# Altium schematic sheet 1_V4.schdoc
size 713 x 330 mm; Name: A_A3; Symbol: A_A3; Device: A_A3; @Project Name: samrtclick; REV: 1; Date: 2023-02-28; Sheet: 1/1; Draw By: kano; Company: Your Company; Convert to PCB: yes; Add into BOM: yes; @Update Date: 2023-05-06; @Page No: 1; @Page Count: 1; @Schematic Name: V4; @Page Name: V4
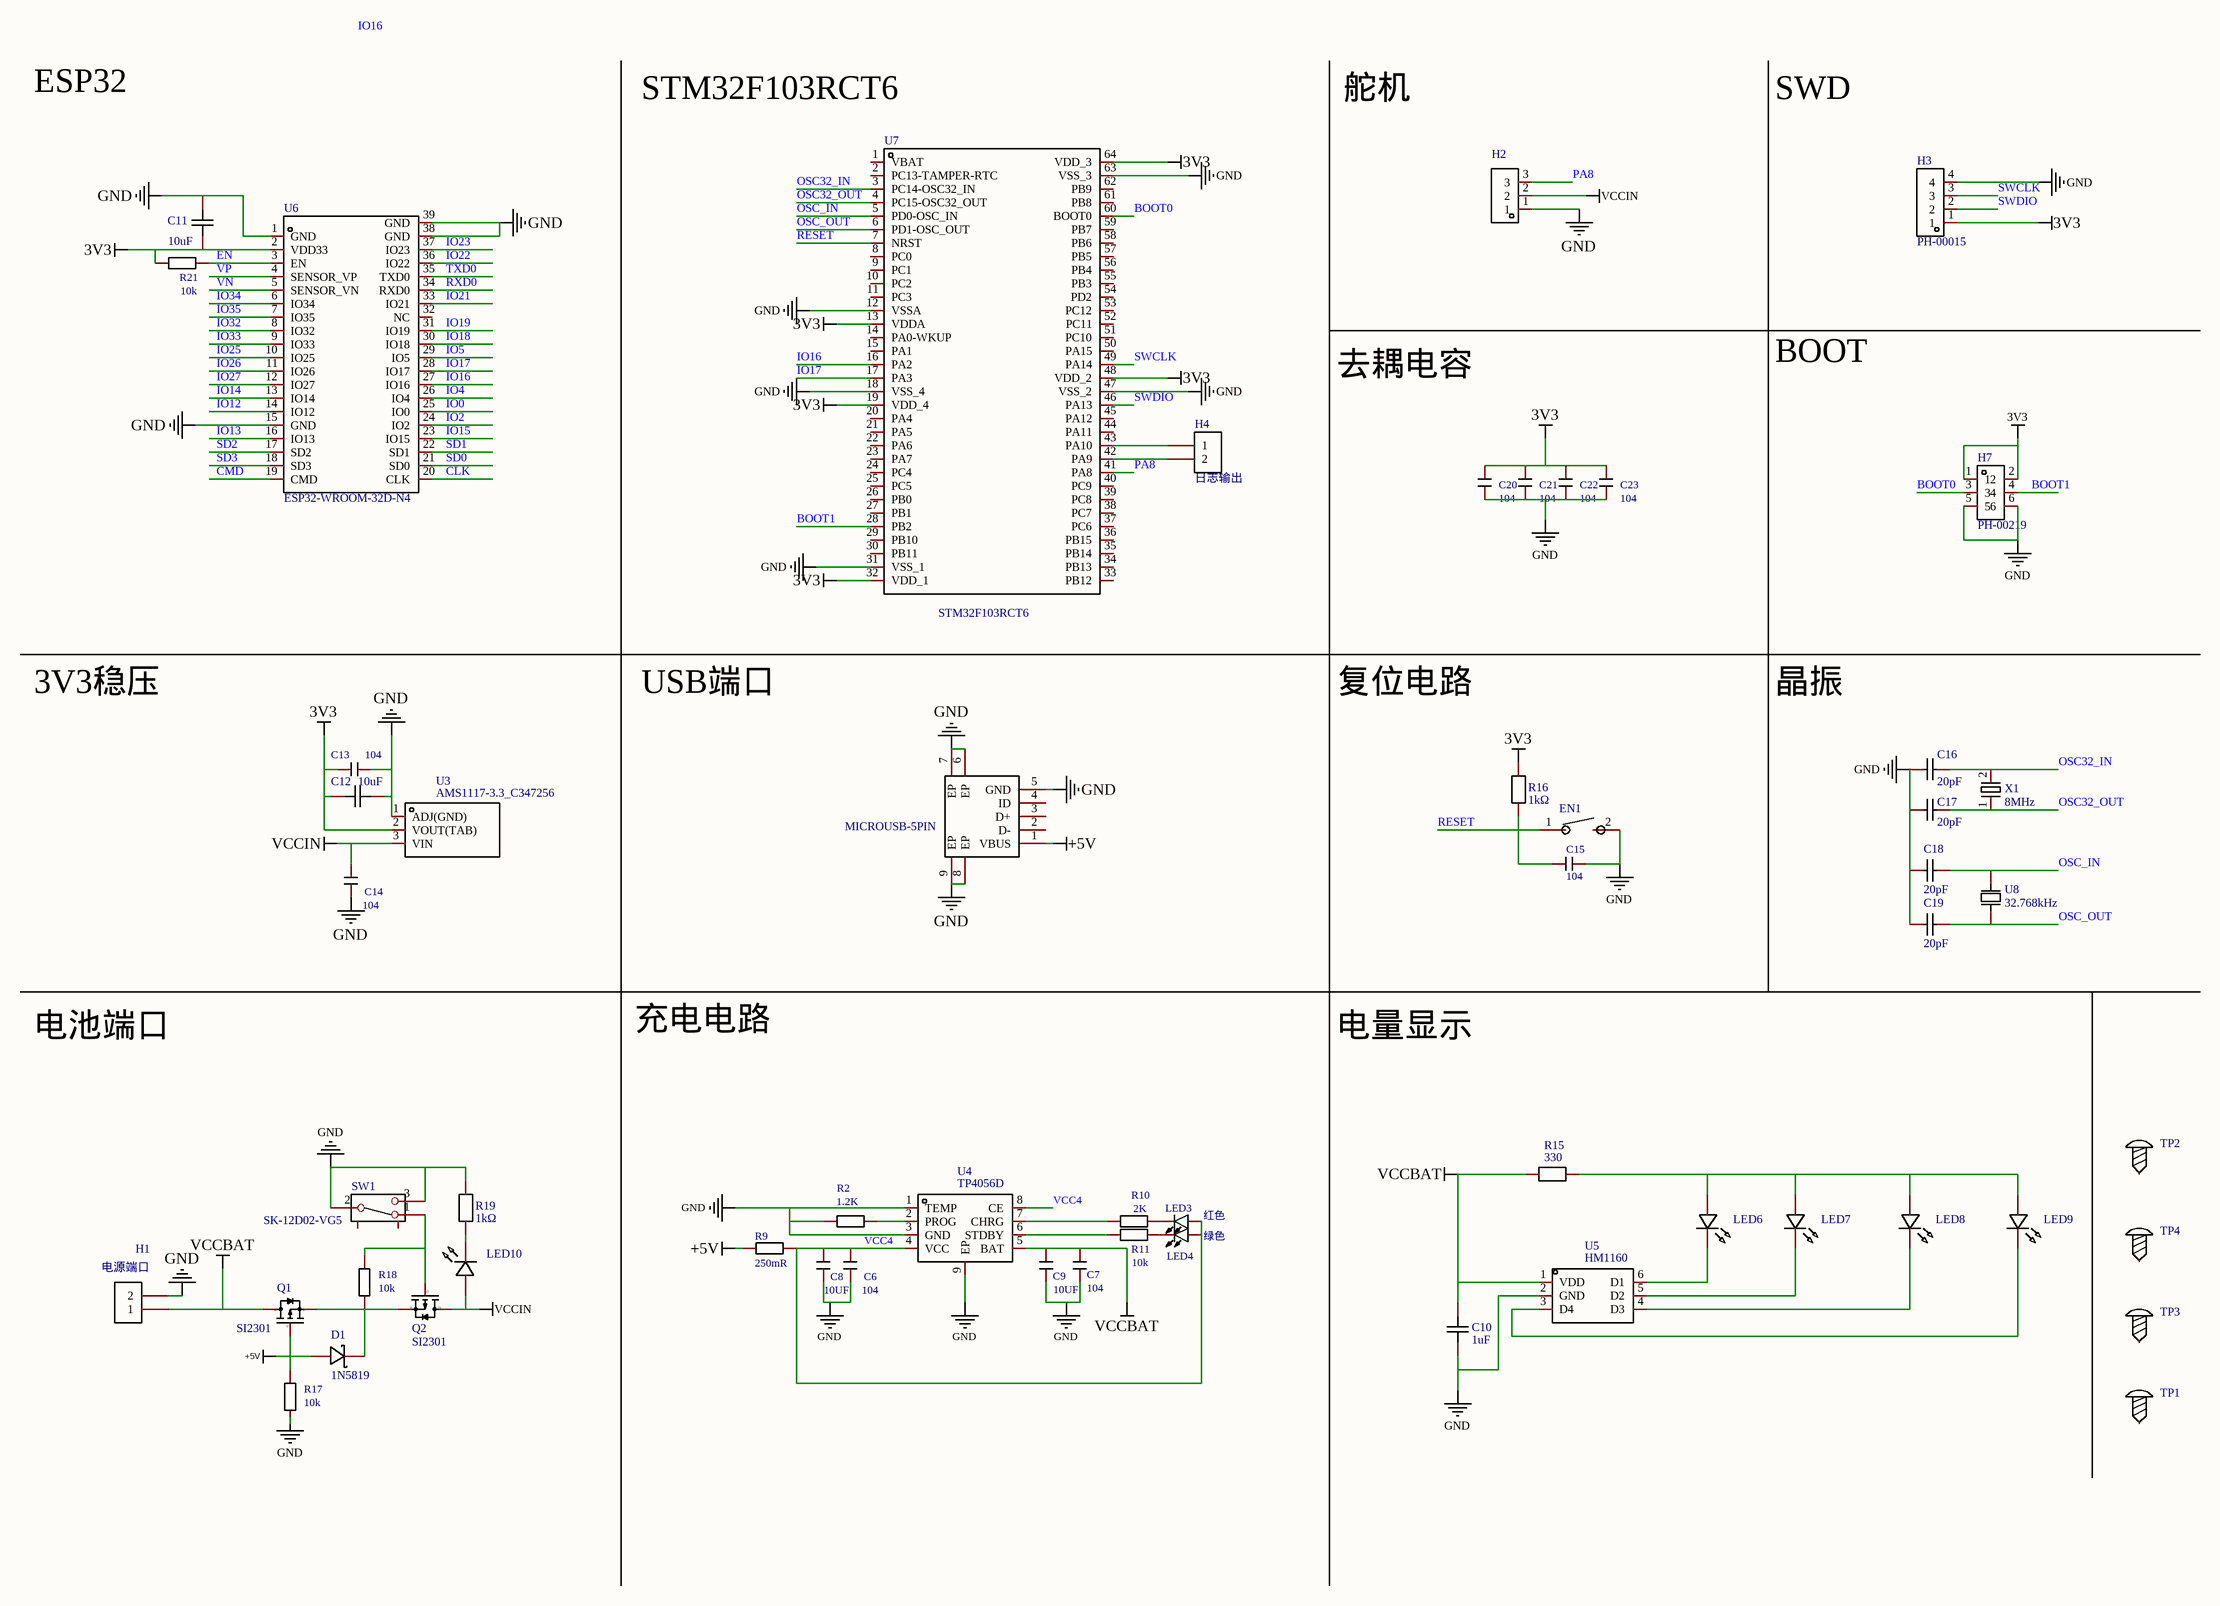
[diagram p0: 1_V4.schdoc]

## Parts
C6  104  [C0603]
C7  104  [C0603]
C8  10UF  [C0805]
C9  10UF  [C0805]
C10  1uF  [C0805]
C11  10uF  [C0603]
C12  10uF  [C0805]
C13  104  [C0603]
C14  104  [C0603]
C15  104  [C0603]
C16  20pF  [C0603]
C17  20pF  [C0603]
C18  20pF  [C0603]
C19  20pF  [C0603]
C20  104  [C0603]
C21  104  [C0603]
C22  104  [C0603]
C23  104  [C0603]
D1  1N5819  [SMA_L4.4-W2.6-LS5.0-RD]
EN1  TSA343G00-250J2  [SW-SMD_L4.0-W2.9-LS5.0]  (value not drawn)
H1  电源端口  [HDR-TH_2P-P2.54-V-M-1]
H2  Z-211-0311-0021-001  [HDR-TH_3P-P2.54-V-M-1]  (value not drawn)
H3  PH-00015  [HDR-TH_4P-P2.54-V-M]
H4  日志输出  [HDR-TH_2P-P2.54-V-M-1]
H7  PH-00219  [HDR-TH_6P-P2.54-V-M-R2-C3-S2.54]
LED3  红色  [L0603-RD]
LED4  绿色  [L0603-RD]
LED6  LED-0603_R  [LED0603_RED]  (value not drawn)
LED7  LED-0603_R  [LED0603_RED]  (value not drawn)
LED8  LED-0603_R  [LED0603_RED]  (value not drawn)
LED9  LED-0603_R  [LED0603_RED]  (value not drawn)
LED10  LED-0603_R  [LED0603_RED]  (value not drawn)
NO1  MICROUSB-5PIN  [USB-SMD_5P_MICROUSB-5PIN]
Q1  SI2301  [SOT-23-3_L2.9-W1.3-P1.90-LS2.4-BR]
Q2  SI2301  [SOT-23-3_L2.9-W1.3-P1.90-LS2.4-BR]
R2  1.2K  [R0603]
R9  250mR  [R1206_1]
R10  2K  [R0603]
R11  10k  [R0603]
R15  330  [R0603]
R16  1kΩ  [R0603]
R17  10k  [R0603]
R18  10k  [R0603]
R19  1kΩ  [R0603]
R21  10k  [R0603]
SW1  SK-12D02-VG5  [SW-TH_SK-12D02-VG5]
TP1  M2螺丝  [M2螺丝]  (value not drawn)
TP2  M2螺丝  [M2螺丝]  (value not drawn)
TP3  M2螺丝  [M2螺丝]  (value not drawn)
TP4  M2螺丝  [M2螺丝]  (value not drawn)
U3  AMS1117-3.3_C347256  [SOT-223-4_L6.5-W3.5-P2.30-LS7.0-BR]
U4  TP4056D  [ESOP-8_L4.9-W3.9-P1.27-LS6.0-TL-EP]
U5  HM1160  [SOT23-6]
U6  ESP32-WROOM-32D-N4  [WIFIM-SMD_39P-L25.5-W18.0-P1.27-BL]
U7  STM32F103RCT6  [LQFP-64_L10.0-W10.0-P0.50-LS12.0-BL]
U8  32.768kHz  [CRYSTAL-SMD_L3.2-W1.5-3]
X1  8MHz  [HC-49S_L11.0-W4.7-P4.88]

## Nets
3V3: C11.1 C12.1 C13.2 C20.1 C21.1 C22.1 C23.1 H3.1 H7.1 H7.2 R16.1 R21.1 U3.2(VOUT(TAB)) U6.2(VDD33) U7.13(VDDA) U7.19(VDD_4) U7.32(VDD_1) U7.48(VDD_2) U7.64(VDD_3)
+5V: D1.2(A) NO1.1(VBUS) Q1.1(G) R9.1 R17.2
GND: C6.1 C7.1 C8.1 C9.1 C10.1 C11.2 C12.2 C13.1 C14.1 C15.1 C16.2 C17.2 C18.2 C19.2 C20.2 C21.2 C22.2 C23.2 EN1.2 H1.2 H2.1 H3.4 H7.5 H7.6 NO1.5(GND) NO1.6(EP) NO1.7(EP) NO1.8(EP) NO1.9(EP) R2.1 R17.1 R19.1 SW1.2 SW1.3 U3.1(ADJ(GND)) U4.1(TEMP) U4.3(GND) U4.9(EP) U5.2(GND) U6.1(GND) U6.15(GND) U6.38(GND) U6.39(GND) U7.12(VSSA) U7.18(VSS_4) U7.31(VSS_1) U7.47(VSS_2) U7.63(VSS_3)
VCCBAT: C7.2 C9.2 C10.2 H1.1 Q1.3(D) R15.1 U4.5(BAT) U5.1(VDD)
VCCIN: C14.2 H2.2 LED10.1 Q2.3(D) U3.3(VIN)
BOOT0: H7.3 U7.60(BOOT0)
BOOT1: H7.4 U7.28(PB2)
CLK: U6.20(CLK)
CMD: U6.19(CMD)
EN: R21.2 U6.3(EN)
IO0: U6.25(IO0)
IO2: U6.24(IO2)
IO4: U6.26(IO4)
IO5: U6.29(IO5)
IO12: U6.14(IO12)
IO13: U6.16(IO13)
IO14: U6.13(IO14)
IO15: U6.23(IO15)
IO16: U6.27(IO16) U7.16(PA2)
IO17: U6.28(IO17) U7.17(PA3)
IO18: U6.30(IO18)
IO19: U6.31(IO19)
IO21: U6.33(IO21)
IO22: U6.36(IO22)
IO23: U6.37(IO23)
IO25: U6.10(IO25)
IO26: U6.11(IO26)
IO27: U6.12(IO27)
IO32: U6.8(IO32)
IO33: U6.9(IO33)
IO34: U6.6(IO34)
IO35: U6.7(IO35)
OSC32_IN: C16.1 U7.3(PC14-OSC32_IN) X1.2(GND)
OSC32_OUT: C17.1 U7.4(PC15-OSC32_OUT) X1.1
OSC_IN: C18.1 U7.5(PD0-OSC_IN) U8.2(OSC2)
OSC_OUT: C19.1 U7.6(PD1-OSC_OUT) U8.1(OSC1)
PA8: H2.3 U7.41(PA8)
RESET: C15.2 EN1.1 R16.2 U7.7(NRST)
RXD0: U6.34(RXD0)
SD0: U6.21(SD0)
SD1: U6.22(SD1)
SD2: U6.17(SD2)
SD3: U6.18(SD3)
SWCLK: H3.3 U7.49(PA14)
SWDIO: H3.2 U7.46(PA13)
TXD0: U6.35(TXD0)
VCC4: C6.2 C8.2 LED3.1(A) LED4.1(A) R9.2 U4.4(VCC) U4.8(CE)
VN: U6.5(SENSOR_VN)
VP: U6.4(SENSOR_VP)
NetD1_1: D1.1(C) Q1.2(S) Q2.2(S) R18.1
NetH4_1: H4.1 U7.43(PA10)
NetH4_2: H4.2 U7.42(PA9)
NetLED3_2: LED3.2(K) R10.2
NetLED4_2: LED4.2(K) R11.2
NetLED6_1: LED6.1 LED7.1 LED8.1 LED9.1 R15.2
NetLED6_2: LED6.2 U5.6(D1)
NetLED7_2: LED7.2 U5.5(D2)
NetLED8_2: LED8.2 U5.4(D3)
NetLED9_2: LED9.2 U5.3(D4)
NetLED10_2: LED10.2 R19.2
NetQ2_1: Q2.1(G) R18.2 SW1.1
NetR2_2: R2.2 U4.2(PROG)
NetR10_1: R10.1 U4.7(CHRG)
NetR11_1: R11.1 U4.6(STDBY)

Not connected (* = marked no-connect by the designer): NO1 2(D-) 3(D+) 4(ID); SW1 4 5; TP1 1; TP2 1; TP3 1; TP4 1; U6 32(NC); U7 1(VBAT) 2(PC13-TAMPER-RTC) 8(PC0) 9(PC1) 10(PC2) 11(PC3) 14(PA0-WKUP) 15(PA1) 20(PA4) 21(PA5) 22(PA6) 23(PA7) 24(PC4) 25(PC5) 26(PB0) 27(PB1) 29(PB10) 30(PB11) 33(PB12) 34(PB13) 35(PB14) 36(PB15) 37(PC6) 38(PC7) 39(PC8) 40(PC9) 44(PA11) 45(PA12) 50(PA15) 51(PC10) 52(PC11) 53(PC12) 54(PD2) 55(PB3) 56(PB4) 57(PB5) 58(PB6) 59(PB7) 61(PB8) 62(PB9)

## Notes on the sheet
- ESP32
- STM32F103RCT6
- 舵机
- SWD
- BOOT
- 去耦电容
- 3V3稳压
- USB端口
- 复位电路
- 晶振
- 电池端口
- 充电电路
- 电量显示
- Labels drawn without touching a wire or pin: IO16
- 2023-05-06
- 1
- V4
- 2
- 3
- 4
- 5
- 6
- 7
- 8
- A
- B
- C
- D
- E
- TITLE:
- REV:
- Date:
- Company:
- Drawn By:
- Sheet:

## Library data of the parts
C6 C7 C13-C15 C20-C23 = 104: 3DModel: C0603_L1.6-W0.8-H0.8; BOM名称: 无极性贴片电容; 版权归属: 源创客; Add into BOM: yes; Name: 104; Symbol: 104; Device: 104; link: https://item.szlcsc.com/362304.html; 学习资源: www.ooocke.com; Convert to PCB: yes; Origin Footprint: C0603
C8 C9 = 10UF: 3DModel: C0805_L2.0-W1.3-H1.3; BOM名称: 无极性贴片电容; 版权归属: 源创客; Add into BOM: yes; Name: 10UF; Symbol: 10UF; Device: 10UF; link: https://item.szlcsc.com/373011.html; 学习资源: www.ooocke.com; Convert to PCB: yes; Origin Footprint: C0805
C10 = 1uF: 3DModel: C0805_L2.0-W1.3-H1.3; Add into BOM: yes; Name: 1uF; Symbol: 1uF; Device: 1uF; link: https://item.szlcsc.com/373011.html; Convert to PCB: yes; Origin Footprint: C0805
C11 = 10uF: 3DModel: C0603_L1.6-W0.8-H0.8; Add into BOM: yes; Name: 10uF; Symbol: 10uF; Device: 10uF; link: https://item.szlcsc.com/362304.html; Convert to PCB: yes; Origin Footprint: C0603
C12 = 10uF: 3DModel: C0805_L2.0-W1.3-H1.3; Add into BOM: yes; Name: 10uF; Symbol: 10uF; Device: 10uF; link: https://item.szlcsc.com/373011.html; Convert to PCB: yes; Origin Footprint: C0805
C16-C19 = CL10C200JB8NNNC: 温度系数:C0G;容值:20pF;精度:±5%;额定电压:50V;; Manufacturer: SAMSUNG(三星); Add into BOM: yes; Temperature Coefficient: C0G; Tolerance: ±5%; Voltage Rated: 50V; Name: 20pF; Symbol: CL10C200JB8NNNC; Device: CL10C200JB8NNNC; LCSC Part Name: 20pF ±5% 50V; Supplier Part: C1648; Manufacturer Part: CL10C200JB8NNNC; Supplier Footprint: 0603; JLCPCB Part Class: Basic Part; Datasheet: https://atta.szlcsc.com/upload/public/pdf/source/20160103/1457707686863.pdf; Supplier: LCSC; Convert to PCB: yes; Value: 20pF
D1 = 1N5819_C437199: 直流反向耐压(Vr):40V;平均整流电流(Io):1A;正向压降(Vf):500mV@1A;; Manufacturer: KEXIN(科信); Add into BOM: yes; Reverse Voltage (Vr): 40V; Average Rectified Current (Io): 1A; Name: 1N5819; Symbol: 1N5819_C437199; Device: 1N5819_C437199; LCSC Part Name: 40V 1A 500mV@1A; Supplier Part: C437199; Manufacturer Part: 1N5819; Supplier Footprint: SMA; JLCPCB Part Class: Extended Part; Datasheet: https://atta.szlcsc.com/upload/public/pdf/source/20191012/C437199_83583E622A6684E767605E43C169C596.pdf; Supplier: LCSC; Convert to PCB: yes; Forward Voltage (Vf@If): 500mV@1A
EN1 = TSA343G00-250J2: 触点电流:50mA;额定电压(DC):12V;绝缘电阻:100MΩ;电路结构:单刀单掷;安装方式:立贴;按钮形状:圆形按钮;按钮/盖帽颜色:黑色;带灯:无;作用力:250gf@±50gf;机械寿命:50000;工作温度:-25℃~+70℃;引脚样式:SMD接片;开关长度:3.95mm;开关宽度:2.9mm;开关高度:2mm;带支架:否;; Manufacturer: BRIGHT(博瑞泰); Add into BOM: yes; Contact Current: 50mA; Voltage Rating (DC): 12V; Insulation Resistance: 100MΩ; Circuit: 单刀单掷; Actuator Style: 圆形按钮; Actuator/Cap Color: 黑色; With Lamp: 无; Mechanical Life: 50000; Pin Style: SMD接片; Switch Length: 3.95mm; Switch Width: 2.9mm; Switch Height: 2mm; Strike Gundam: 否; Actuator Orientation: 顶部触动; 3DModel: SW-SMD_L4.0-W2.9-H2-P4.15-EH; Paste Type: expand; Origin Footprint: SW-SMD_L4.0-W2.9-P4.15-EH; Name: TSA343G00-250J2; Symbol: TSA343G00-250J2; Device: TSA343G00-250J2; LCSC Part Name: 3*4 两脚小龟不带柱  250gf; Supplier Part: C354946; Manufacturer Part: TSA343G00-250J2; Supplier Footprint: SMD; JLCPCB Part Class: Extended Part; Datasheet: https://atta.szlcsc.com/upload/public/pdf/source/20190426/C354946_6B70DFBDFA823D17B8EB46FB9599F693.pdf; Supplier: LCSC; Convert to PCB: yes; Mounting Style: 立贴; Operating Force: 250gf@±50gf; Operating Temperature: -25℃~+70℃; Illumination Color: -; link: https://item.szlcsc.com/457634.html; Assembly Type: smtWeld
H1 H4 = 电源端口: Manufacturer: TE Connectivity(美国泰科); Manufacturer Part: 3-644456-2; 3DModel: HDR-M-2.54_1x2; Add into BOM: yes; Symbol: 电源端口; Device: 电源端口; link: https://item.szlcsc.com/366904.html; Supplier: LCSC; Supplier Part: C90288; JLCPCB Part Class: Extended Part; Convert to PCB: yes; Origin Footprint: HDR-TH_2P-P2.54-V-M-1
  H1: Name: 电源端口
  H4: Name: 日志输出
H2 = Z-211-0311-0021-001: Manufacturer: Nextron(正凌); 3DModel: HDR-M-2.54_1x3; Add into BOM: yes; Name: Z-211-0311-0021-001; Symbol: Z-211-0311-0021-001; Device: Z-211-0311-0021-001; link: https://item.szlcsc.com/50265.html; Supplier: LCSC; Manufacturer Part: Z-211-0311-0021-001; Supplier Part: C152153; JLCPCB Part Class: Extended Part; Convert to PCB: yes; Origin Footprint: HDR-TH_3P-P2.54-V-M-1
H3 = PH-00015: 排数:单排;总PIN位数:4;间距:2.54mm;插针结构:1x4P;行距:-;安装类型:直插;圆针/方针:方针;额定电流:3A;额定电压:-;配合针长度:6mm;塑高:2.5mm;端接针长度:3mm;触头材质:-;工作温度范围:-40℃~+105℃;颜色:黑色;; Manufacturer: Liansheng(连盛); Add into BOM: yes; Pitch: 2.54mm; Pin Structure: 1x4P; Circluar Pins/Square Pins: 方针; Current Rating (Max): 3A; Name: PH-00015; Symbol: PH-00015; Device: PH-00015; LCSC Part Name: 2.54mm 1x4P 直插 方针; Supplier Part: C2829888; Manufacturer Part: PH-00015; Supplier Footprint: 直插,P=2.54mm; JLCPCB Part Class: Extended Part; Datasheet: https://atta.szlcsc.com/upload/public/pdf/source/20210507/C2829888_39A693133DEF85B8C06C0B5A72669F0A.pdf; Supplier: LCSC; Convert to PCB: yes; Number of Rows: 单排; Number of Pins: 4; Row Spacing: -; Mounting Type: 直插; Voltage Rating (Max): -; Length of Mating Pin: 6mm; Insulation Height: 2.5mm; Length of End Connection Pin: 3mm; Contact Material: -; Operating Temperature Range: -40℃~+105℃; Color: 黑色
H7 = PH-00219: 排数:双排;总PIN位数:6;间距:2.54mm;插针结构:2x3P;行距:2.54mm;安装类型:直插;圆针/方针:方针;额定电流:3A;额定电压:-;配合针长度:6mm;塑高:2.5mm;端接针长度:3mm;触头材质:-;工作温度范围:-40℃~+105℃;颜色:黑色;; Manufacturer: Liansheng(连盛); Add into BOM: yes; Pitch: 2.54mm; Pin Structure: 2x3P; Circluar Pins/Square Pins: 方针; Current Rating (Max): 3A; Name: PH-00219; Symbol: PH-00219; Device: PH-00219; LCSC Part Name: 2.54mm 2x3P 直插 方针; Supplier Part: C2685145; Manufacturer Part: PH-00219; Supplier Footprint: 直插,P=2.54mm; JLCPCB Part Class: Extended Part; Datasheet: https://atta.szlcsc.com/upload/public/pdf/source/20210126/C2685145_A66242120F6807E5DA74F898CBC599A0.pdf; Supplier: LCSC; Convert to PCB: yes; Number of Rows: 双排; Number of Pins: 6; Row Spacing: 2.54mm; Mounting Type: 直插; Voltage Rating (Max): -; Length of Mating Pin: 6mm; Insulation Height: 2.5mm; Length of End Connection Pin: 3mm; Contact Material: -; Operating Temperature Range: -40℃~+105℃; Color: 黑色
LED3 = 红色: BOM名称: 贴片LED; 版权归属: 源创客; Add into BOM: yes; Name: 红色; Symbol: 红色; Device: 红色; link: https://atta.szlcsc.com/upload/public/pdf/source/20180326/C98007_E988380F54303ED5DB1EDD3A08ED9857.pdf; 3DModel: L0603-RD; 学习资源: www.ooocke.com; Convert to PCB: yes; Origin Footprint: L0603-RD
LED4 = 绿色: BOM名称: 贴片LED; 版权归属: 源创客; Add into BOM: yes; Name: 绿色; Symbol: 绿色; Device: 绿色; link: https://atta.szlcsc.com/upload/public/pdf/source/20180326/C98007_E988380F54303ED5DB1EDD3A08ED9857.pdf; 3DModel: L0603-RD; 学习资源: www.ooocke.com; Convert to PCB: yes; Origin Footprint: L0603-RD
LED6-LED10 = LED-0603_R: Manufacturer: EVERLIGHT(台湾亿光); Manufacturer Part: 19-217/R6C-AL1M2VY/3T; Add into BOM: yes; Name: LED-0603_R; Symbol: LED-0603_R; Device: LED-0603_R; 3DModel: LED0603_Red; Supplier Part: C72044; Supplier: LCSC; Convert to PCB: yes; Origin Footprint: LED0603_RED
NO1 = MICROUSB-5PIN: Add into BOM: yes; Name: MICROUSB-5PIN; Symbol: MICROUSB-5PIN; Device: MICROUSB-5PIN; link: https://wenku.baidu.com/view/86fe0d6b3968011ca200912d.html; 3DModel: USB-SMD_5P_MICROUSB-5PIN; Supplier: LCSC; Supplier Part: C9900001196; Manufacturer Part: MicroUSB-5PIN; JLCPCB Part Class: Extended Part; Convert to PCB: yes; Origin Footprint: USB-SMD_5P_MICROUSB-5PIN; NO_CONNECT: yes
Q1 Q2 = SI2301_C181086: 导通电阻(RDS(on)@Vgs,Id):120mΩ 2.8A,4.5V;阈值电压(Vgs(th)@Id):1V 250μA;漏源电压(Vdss):20V;连续漏极电流(Id):2.3A;类型:P沟道;功率(Pd):1.25W;; Manufacturer: Hottech(合科泰); Add into BOM: yes; Drain Source Voltage (Vdss): 20V; Continuous Drain Current (Id): 2.3A; Type: P沟道; Power Dissipation (Pd): 1.25W; Name: SI2301; Symbol: SI2301; Device: SI2301_C181086; LCSC Part Name: SI2301; Supplier Part: C181086; Manufacturer Part: SI2301; Supplier Footprint: SOT-23(SOT-23-3); JLCPCB Part Class: Extended Part; Datasheet: https://atta.szlcsc.com/upload/public/pdf/source/20180131/C181086_15173931923361329215.pdf; Supplier: LCSC; Convert to PCB: yes; Drain Source On Resistance (RDS(on)@Vgs,Id): 120mΩ 2.8A,4.5V; Gate Threshold Voltage (Vgs(th)@Id): 1V 250μA
R2 = 1K: BOM名称: 贴片电阻; 版权归属: 源创客; Add into BOM: yes; Name: 1.2K; Symbol: 1K; Device: 1K; 3DModel: R0603; link: https://www.mouser.in/datasheet/2/447/PYu_RT_1_to_0_01_RoHS_L_11-1669912.pdf; 学习资源: www.ooocke.com; Convert to PCB: yes; Origin Footprint: R0603
R9 = 250mR: BOM名称: 贴片电阻; 版权归属: 源创客; Add into BOM: yes; Name: 250mR; Symbol: 250mR; Device: 250mR; link: https://item.szlcsc.com/311874.html; 学习资源: www.ooocke.com; Convert to PCB: yes; Origin Footprint: R1206_1
R10 = 2K: BOM名称: 贴片电阻; 版权归属: 源创客; Add into BOM: yes; Name: 2K; Symbol: 2K; Device: 2K; 3DModel: R0603; link: https://www.mouser.in/datasheet/2/447/PYu_RT_1_to_0_01_RoHS_L_11-1669912.pdf; 学习资源: www.ooocke.com; Convert to PCB: yes; Origin Footprint: R0603
R11 R17 R18 R21 = 10k: BOM名称: 贴片电阻; 版权归属: 源创客; Add into BOM: yes; Name: 10k; Symbol: 10k; Device: 10k; 3DModel: R0603; link: https://www.mouser.in/datasheet/2/447/PYu_RT_1_to_0_01_RoHS_L_11-1669912.pdf; 学习资源: www.ooocke.com; Convert to PCB: yes; Origin Footprint: R0603
R15 = 330: Add into BOM: yes; Name: 330; Symbol: 330; Device: 330; 3DModel: R0603; link: https://www.mouser.in/datasheet/2/447/PYu_RT_1_to_0_01_RoHS_L_11-1669912.pdf; Convert to PCB: yes; Origin Footprint: R0603
R16 R19 = ERA3VEB1001V: 温度系数:±25ppm/K;温度系数:±25ppm/K;工作温度范围:-55℃~+155℃;工作温度范围:-55℃~+155℃;精度:±0.1%;最大工作电压:100V;类型:薄膜电阻;功率:125mW;阻值:1kΩ;; Manufacturer: PANASONIC(松下); Add into BOM: yes; Tolerance: ±0.1%; Overload Voltage (Max): 100V; Power(Watts): 125mW; 3DModel: R0603_L1.6-W0.8-H0.8; Name: 1kΩ; Symbol: ERA3VEB1001V; Device: ERA3VEB1001V; LCSC Part Name: 1KΩ(1001) ±0.1%; Supplier Part: C490794; Manufacturer Part: ERA3VEB1001V; Supplier Footprint: 0603; JLCPCB Part Class: Extended Part; Datasheet: https://atta.szlcsc.com/upload/public/pdf/source/20200407/C490794_144E786BD6B5906C11E86C00580B1EF5.pdf; Supplier: LCSC; Convert to PCB: yes; Temperature Coefficient: ±25ppm/K; Operating Temperature Range: -55℃~+155℃; Type: 薄膜电阻; Value: 1kΩ; link: https://item.szlcsc.com/137208.html; Origin Footprint: R0603
SW1 = SK-12D02-VG5_C136722: 额定电流(DC):-;额定电压(DC):-;额定电流(AC):-;额定电压(AC):-;电路结构:单刀双掷;安装方式:卧插;机械寿命:5000;滑钮形状:矩形柱状;引脚样式:PC引脚;工作温度:-25℃~+70℃;开关高度:9.5mm;; Manufacturer: 韩国韩荣; Add into BOM: yes; Circuit: 单刀双掷; Mechanical Life: 5000; Actuator Style: 矩形柱状; Pin Style: PC引脚; Switch Height: 9.5mm; Name: SK-12D02-VG5; Symbol: SK-12D02-VG5; Device: SK-12D02-VG5_C136722; LCSC Part Name: SK-12D02-VG5; Supplier Part: C136722; Manufacturer Part: SK-12D02-VG5; Supplier Footprint: 插件; JLCPCB Part Class: Extended Part; Datasheet: https://atta.szlcsc.com/upload/public/pdf/source/20180731/C136723_39114FC09BF2E9DC98823B78B7234B45.pdf; Supplier: LCSC; Convert to PCB: yes; Current Rating (DC): -; Voltage Rating (DC): -; Current Rating (AC): -; Voltage Rating (AC): -; Mounting Style: 卧插; Operating Temperature: -25℃~+70℃
TP1-TP4 = M2螺丝: Symbol: 螺丝孔; Convert to PCB: yes; Device: M2螺丝; Add into BOM: yes; Supplier Footprint: 插件
U3 = AMS1117-3.3_C347256: Manufacturer: Youtai Semiconductor Co., Ltd.; 3DModel: SOT-223-4P_L6.5-W3.5-H1.6-LS7.0-P2.30; Paste Type: expand; Add into BOM: yes; Name: AMS1117-3.3_C347256; Symbol: AMS1117-3.3_C347256; Device: AMS1117-3.3_C347256; link: https://item.szlcsc.com/84517.html; Supplier: LCSC; Supplier Part: C347256; Manufacturer Part: AMS1117-3.3; Assembly Type: smtWeld; Convert to PCB: yes; Origin Footprint: SOT-223-4_L6.5-W3.5-P2.30-LS7.0-BR
U4 = TP4056D: Manufacturer: 拓微集成; 3DModel: ESOP-8_L4.9-W3.9-H1.6-LS6.0-P1.27; Add into BOM: yes; Name: TP4056D; Symbol: TP4056D; Device: TP4056D; link: https://img.jlc.com/pdf/applyPasteComponent/2022-01-14/296412A/fe074eb14c014e62a4772fc0c12ab405/TP4056D.pdf; Supplier: LCSC; Supplier Part: C9900006240; Manufacturer Part: TP4056D; JLCPCB Part Class: Extended Part; Convert to PCB: yes; Origin Footprint: ESOP-8_L4.9-W3.9-P1.27-LS6.0-TL-EP
U5 = HM1160: Manufacturer: Shenzhen Chip Hope Micro-Electronics; Manufacturer Part: LP3772-1; Add into BOM: yes; Name: HM1160; Symbol: HM1160; Device: HM1160; Supplier: LCSC; Supplier Part: C360132; Convert to PCB: yes; Origin Footprint: SOT23-6
U6 = ESP32-WROOM-32D-N4_C473012: ESP32-WROOM-32D 集成 ESP32-D0WD，功能强大，用途广泛，可以用于低功耗传感器网络和要求极高的任务，例如语音编码、音频流和 MP3 解码等。; Manufacturer: ESPRESSIF(乐鑫); Add into BOM: yes; Name: ESP32-WROOM-32D-N4; Symbol: ESP32-WROOM-32D; Device: ESP32-WROOM-32D-N4_C473012; LCSC Part Name: ESP32-WROOM-32D-N4; Supplier Part: C473012; Manufacturer Part: ESP32-WROOM-32D-N4; Supplier Footprint: SMD,18x25.5mm; JLCPCB Part Class: Extended Part; Datasheet: https://atta.szlcsc.com/upload/public/pdf/source/20191225/C473012_1E74417EE995DBCF17C94BD318A37DAB.pdf; Supplier: LCSC; Convert to PCB: yes; NO_CONNECT: yes
U7 = STM32F103RCT6: 工作电压:2V ~ 3.6V;主频（MAX):72MHz;; Manufacturer: ST(意法半导体); Add into BOM: yes; UART/USART: 3 USART+2 UART; SPI: 3; USB Device: 1; PWM: 18; LCD: LCD parallel interface, 8080/6800 modes; I2C（SMBUS/PMBUS）: 2; A/D: 16x12bit; D/A: 2x12bit; Program Memory Size: 256KB; RAM Size: 48KB; Speed: 72MHz; Number of I/O: 51; Name: STM32F103RCT6; Symbol: STM32F103RCT6; Device: STM32F103RCT6; LCSC Part Name: STM32F103RCT6; Supplier Part: C8323; Manufacturer Part: STM32F103RCT6; Supplier Footprint: LQFP-64_10x10x05P; JLCPCB Part Class: Basic Part; Datasheet: https://atta.szlcsc.com/upload/public/pdf/source/20161130/1480498797345.pdf; Supplier: LCSC; Convert to PCB: yes; Voltage - Supply (Vcc/Vdd): 2V ~ 3.6V; CAN: 1
U8 = X1A0000910001: 晶振类型:贴片无源晶振;频率:32.768kHz;频率公差:±20ppm;负载电容:12.5pF;工作温度:-40℃~+125℃;; Manufacturer: EPSON(爱普生); Add into BOM: yes; Crystal Type: 贴片无源晶振; Frequency Tolerance: ±20ppm; Load Capacitance: 12.5pF; Name: 32.768kHz; Symbol: X1A0000910001; Device: X1A0000910001; LCSC Part Name: 32.768kHz ±20ppm 12.5pF; Supplier Part: C841880; Manufacturer Part: X1A0000910001; Supplier Footprint: SMD3215-2P; JLCPCB Part Class: Extended Part; Datasheet: https://atta.szlcsc.com/upload/public/pdf/source/20200925/C841880_D4087E5EAF96E151F1F70ED7FD14B86A.pdf; Supplier: LCSC; Convert to PCB: yes; Value: 32.768kHz; Operating Temperature: -40℃~+125℃
X1 = X49ST2-8.000-F20JGDT: 晶振类型:49S晶振;频率:8MHz;频率公差:±30ppm;频率稳定度:±50ppm;负载电容:20pF;等效串联电阻(ESR):60Ω;工作温度:-40℃~+85℃;; Manufacturer: HCI(杭晶); Add into BOM: yes; Crystal Type: 49S晶振; Frequency Tolerance: ±30ppm; Frequency Stability: ±50ppm; Load Capacitance: 20pF; Equivalent Series Resistance (ESR): 60Ω; Name: 8MHz; Symbol: X49ST2-8.000-F20JGDT; Device: X49ST2-8.000-F20JGDT; LCSC Part Name: 8MHz ±30ppm 20pF; Supplier Part: C2842312; Manufacturer Part: X49ST2-8.000-F20JGDT; Supplier Footprint: HC-49S; JLCPCB Part Class: Extended Part; Datasheet: https://atta.szlcsc.com/upload/public/pdf/source/20220525/0143EE8D34C0AE1CB034EEA084D0A382.pdf; Supplier: LCSC; Convert to PCB: yes; Value: 8MHz; Operating Temperature: -40℃~+85℃